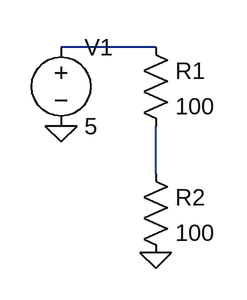
[diagram p0: schematic Draft1.asc]
Draft1.asc, the LTspice schematic file:
Version 4
SHEET 1 880 680
WIRE 16 48 -80 48
WIRE 16 176 16 128
FLAG 16 256 0
FLAG -80 128 0
SYMBOL res 0 32 R0
SYMATTR InstName R1
SYMATTR Value 100
SYMBOL res 0 160 R0
SYMATTR InstName R2
SYMATTR Value 100
SYMBOL voltage -80 32 R0
WINDOW 123 0 0 Left 0
WINDOW 39 0 0 Left 0
SYMATTR InstName V1
SYMATTR Value 5

The netlist it stands for:
* Draft1.asc
R1 N001 N002 100
R2 N002 0 100
V1 N001 0 5
.backanno
.end